# Altium schematic sheet INTERFACE.SchDoc
size A4
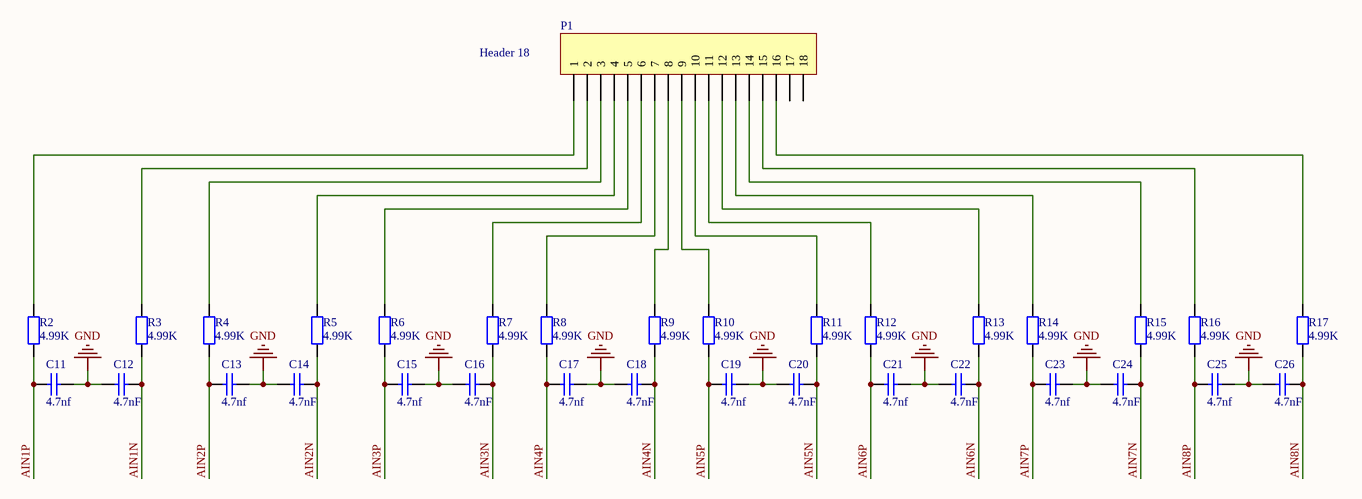
[diagram p0: INTERFACE.SchDoc]

## Parts
C11  4.7nf  [CAP-C0603-H0.9mm]
C12  4.7nF  [CAP-C0603-H0.9mm]
C13  4.7nf  [CAP-C0603-H0.9mm]
C14  4.7nF  [CAP-C0603-H0.9mm]
C15  4.7nf  [CAP-C0603-H0.9mm]
C16  4.7nF  [CAP-C0603-H0.9mm]
C17  4.7nf  [CAP-C0603-H0.9mm]
C18  4.7nF  [CAP-C0603-H0.9mm]
C19  4.7nf  [CAP-C0603-H0.9mm]
C20  4.7nF  [CAP-C0603-H0.9mm]
C21  4.7nf  [CAP-C0603-H0.9mm]
C22  4.7nF  [CAP-C0603-H0.9mm]
C23  4.7nf  [CAP-C0603-H0.9mm]
C24  4.7nF  [CAP-C0603-H0.9mm]
C25  4.7nf  [CAP-C0603-H0.9mm]
C26  4.7nF  [CAP-C0603-H0.9mm]
P1  Header 18  [HDR1X18]
R2  4.99K  [RES-0805-H0.6mm]
R3  4.99K  [RES-0805-H0.6mm]
R4  4.99K  [RES-0805-H0.6mm]
R5  4.99K  [RES-0805-H0.6mm]
R6  4.99K  [RES-0805-H0.6mm]
R7  4.99K  [RES-0805-H0.6mm]
R8  4.99K  [RES-0805-H0.6mm]
R9  4.99K  [RES-0805-H0.6mm]
R10  4.99K  [RES-0805-H0.6mm]
R11  4.99K  [RES-0805-H0.6mm]
R12  4.99K  [RES-0805-H0.6mm]
R13  4.99K  [RES-0805-H0.6mm]
R14  4.99K  [RES-0805-H0.6mm]
R15  4.99K  [RES-0805-H0.6mm]
R16  4.99K  [RES-0805-H0.6mm]
R17  4.99K  [RES-0805-H0.6mm]

## Nets
GND: C11.1 C12.2 C13.1 C14.2 C15.1 C16.2 C17.1 C18.2 C19.1 C20.2 C21.1 C22.2 C23.1 C24.2 C25.1 C26.2
AIN1N: C12.1 R3.1
AIN1P: C11.2 R2.1
AIN2N: C14.1 R5.1
AIN2P: C13.2 R4.1
AIN3N: C16.1 R7.1
AIN3P: C15.2 R6.1
AIN4N: C18.1 R9.1
AIN4P: C17.2 R8.1
AIN5N: C20.1 R11.1
AIN5P: C19.2 R10.1
AIN6N: C22.1 R13.1
AIN6P: C21.2 R12.1
AIN7N: C24.1 R15.1
AIN7P: C23.2 R14.1
AIN8N: C26.1 R17.1
AIN8P: C25.2 R16.1
NetP1_1: P1.1 R2.2
NetP1_2: P1.2 R3.2
NetP1_3: P1.3 R4.2
NetP1_4: P1.4 R5.2
NetP1_5: P1.5 R6.2
NetP1_6: P1.6 R7.2
NetP1_7: P1.7 R8.2
NetP1_8: P1.8 R9.2
NetP1_9: P1.9 R10.2
NetP1_10: P1.10 R11.2
NetP1_11: P1.11 R12.2
NetP1_12: P1.12 R13.2
NetP1_13: P1.13 R14.2
NetP1_14: P1.14 R15.2
NetP1_15: P1.15 R16.2
NetP1_16: P1.16 R17.2

Not connected (* = marked no-connect by the designer): P1 17 18

## Library data of the parts
C11-C26 = C0603: CER 10UF 25V X8R 1210; Supplier 1: Digi-Key; Supplier Part Number 1: 445-174833-1-ND; digikey part number: 478-1244-1-ND; Parameter 1: *
P1 = Header 18: Header, 18-Pin; LatestRevisionDate: 17-Jul-2002; LatestRevisionNote: Re-released for DXP Platform.; Publisher: Altium Limited
R2-R17 = R: RES SMD 33 OHM 1% 1/10W 0603; CMT: 1k; Supplier 1: Digi-Key; Supplier Part Number 1: 311-33.0HRCT-ND